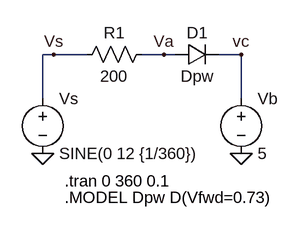
[diagram p0: schematic 7-2-1-a-1.asc]
7-2-1-a-1.asc, the LTspice schematic file:
Version 4
SHEET 1 880 680
WIRE 192 112 176 112
WIRE 240 112 192 112
WIRE 352 112 320 112
WIRE 368 112 352 112
WIRE 464 112 432 112
WIRE 176 176 176 112
WIRE 464 176 464 112
FLAG 176 256 0
FLAG 464 256 0
FLAG 192 112 Vs
FLAG 352 112 Va
FLAG 464 112 vc
SYMBOL voltage 176 160 R0
WINDOW 123 0 0 Left 0
WINDOW 39 0 0 Left 0
SYMATTR InstName Vs
SYMATTR Value SINE(0 12 {1/360})
SYMBOL res 336 96 R90
WINDOW 0 0 56 VBottom 2
WINDOW 3 32 56 VTop 2
SYMATTR InstName R1
SYMATTR Value 200
SYMBOL diode 368 128 R270
WINDOW 0 32 32 VTop 2
WINDOW 3 0 32 VBottom 2
SYMATTR InstName D1
SYMATTR Value Dpw
SYMBOL voltage 464 160 R0
WINDOW 123 0 0 Left 0
WINDOW 39 0 0 Left 0
SYMATTR InstName Vb
SYMATTR Value 5
TEXT 208 296 Left 2 !.tran 0 360 0.1
TEXT 208 320 Left 2 !.MODEL Dpw D(Vfwd=0.73)

The netlist it stands for:
* 7-2-1-a-1.asc
Vs Vs 0 SINE(0 12 {1/360})
R1 Va Vs 200
D1 Va vc Dpw
Vb vc 0 5
.model D D
.lib standard.dio
.tran 0 360 0.1
.MODEL Dpw D(Vfwd=0.73)
.backanno
.end